# Altium project pca10090.PrjPCB (part 1 of 5)
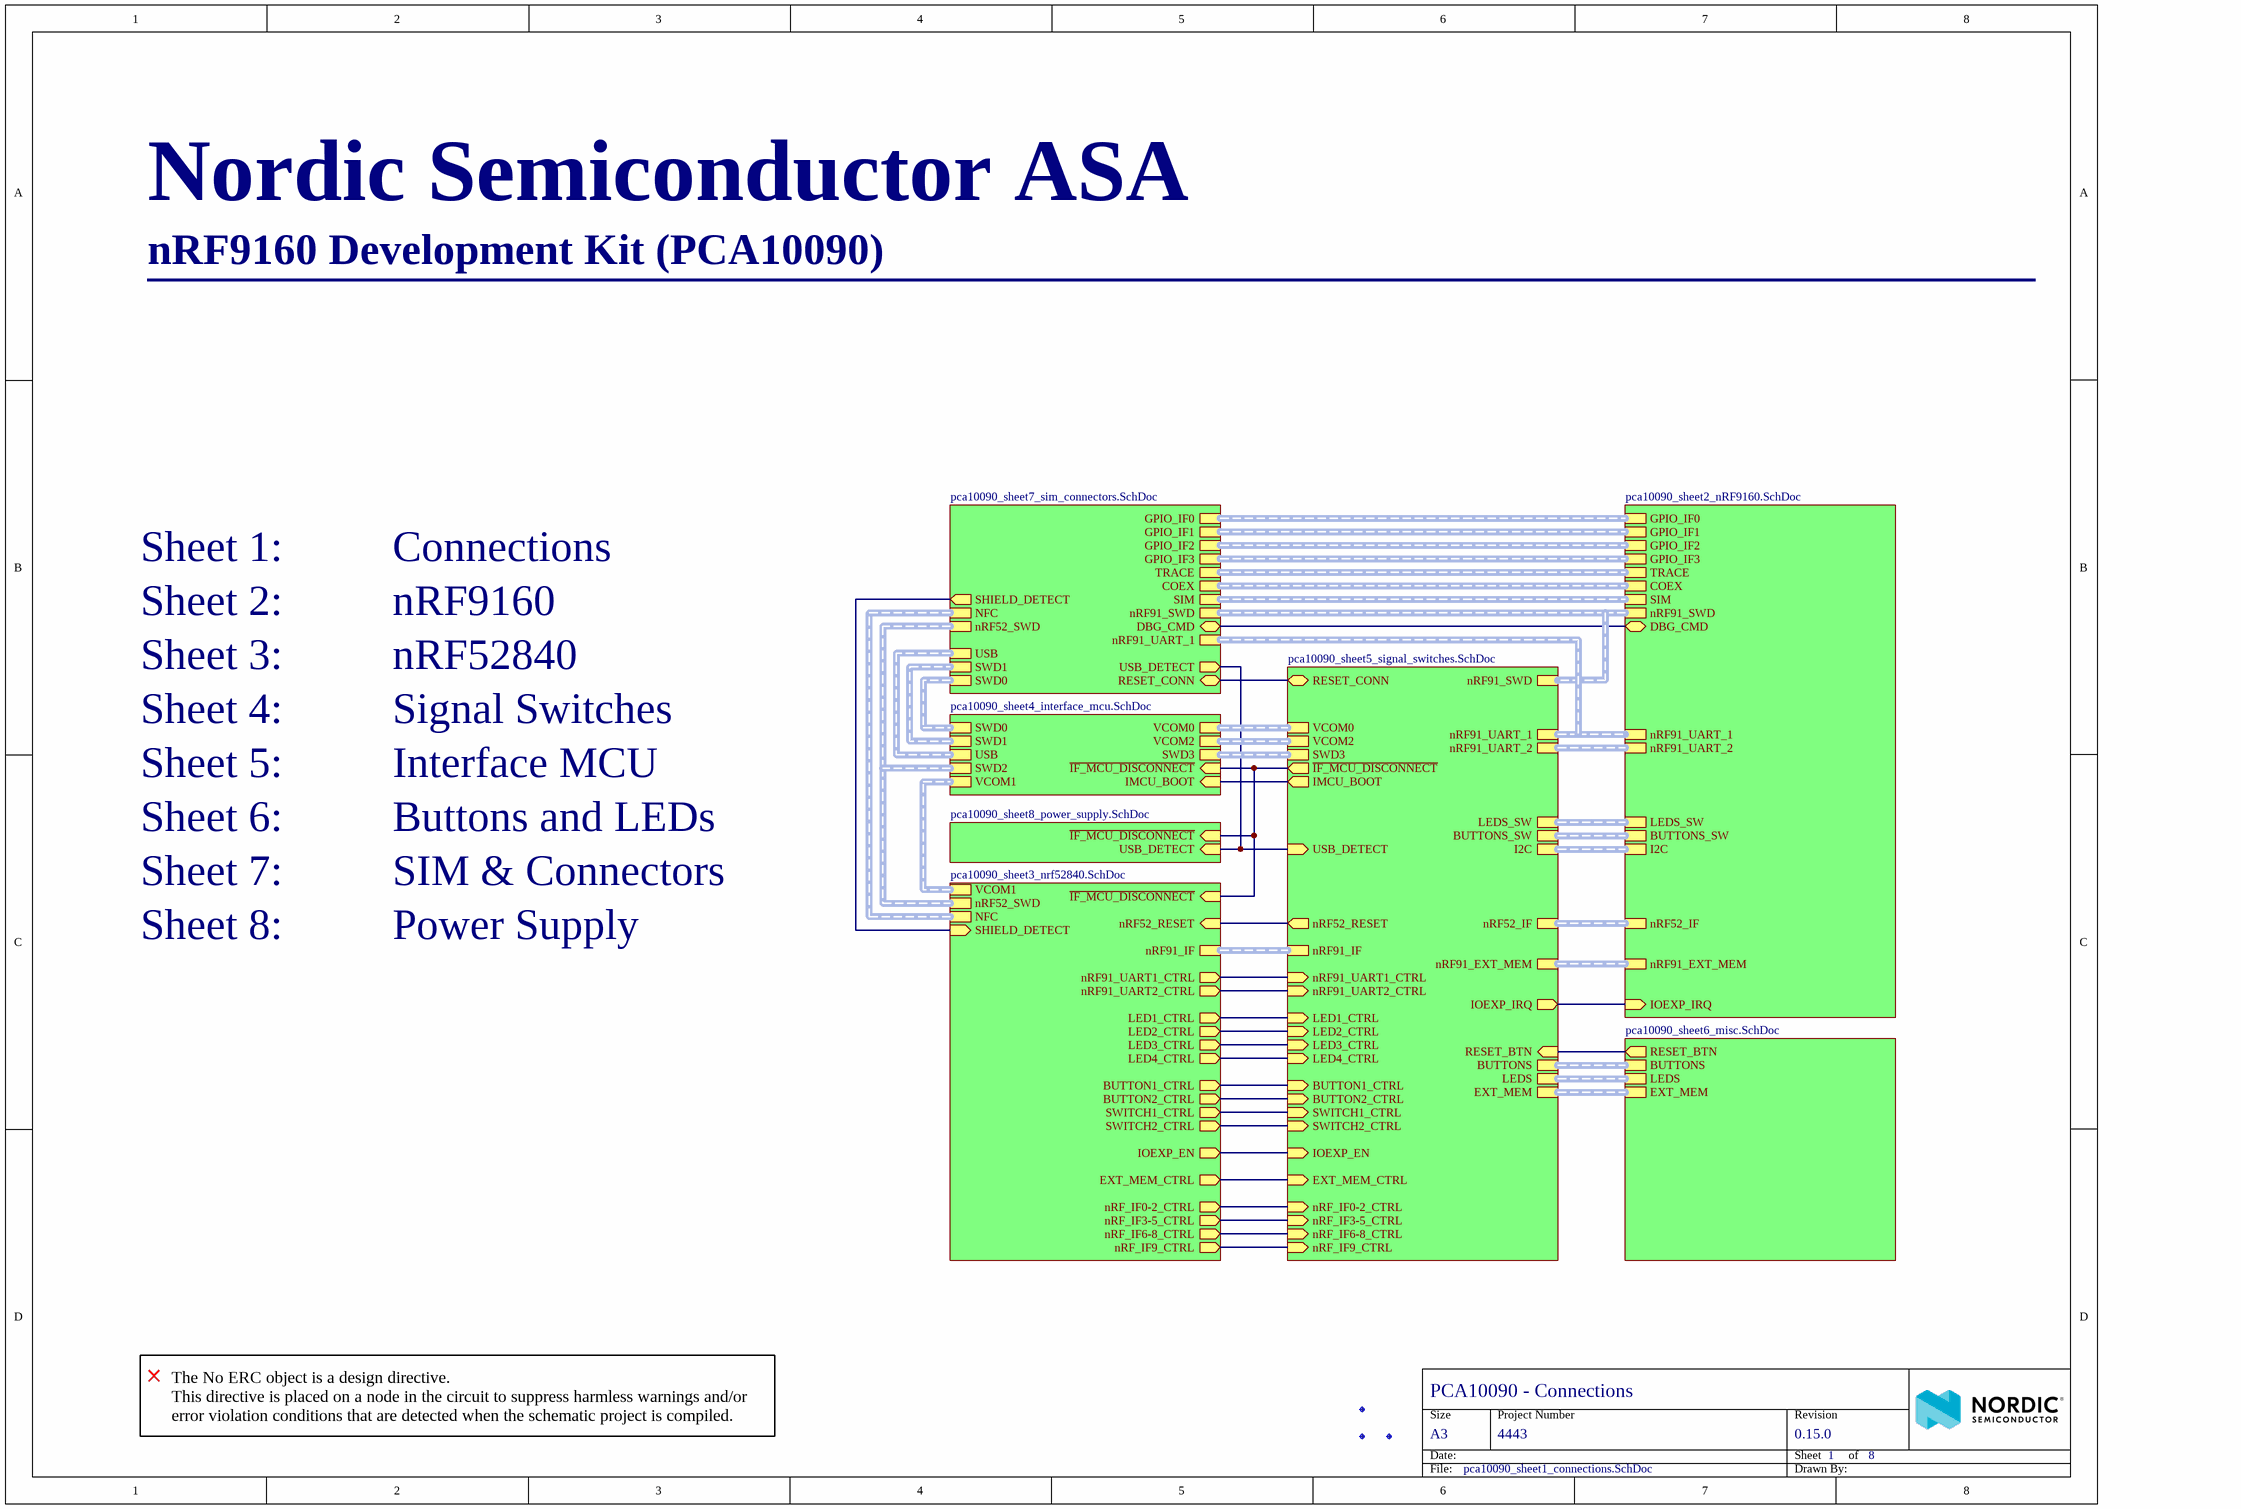
[diagram p0: pca10090_sheet1_connections.SchDoc]
SurfaceFinish: ENIG; SoldermaskColor: Blue; SilkscreenColor: White; Revision: 0.15.0; ProjectNumber: 4443; ProjectName: nRF9160-DK; PCBStackup: 4021; PCBRevision: 0386RUBR; PCBNumber: 400389; PCAName: PCA10090; Organization: Nordic Semiconductor; NrOfLayers: 4; BoardTitle: nRF9160-DK; BoardThickness: 1.6mm; Author: RUBR
8 sheets, 434 parts. Net scope: hierarchical (ports join the sheet entries above them; power ports are global).
Board file: 400389.PcbDoc
Sheets:
  pca10090_sheet1_connections.SchDoc
     = pca10090_sheet2_nRF9160.SchDoc
     = pca10090_sheet3_nrf52840.SchDoc
     = pca10090_sheet4_interface_mcu.SchDoc
     = pca10090_sheet5_signal_switches.SchDoc
     = pca10090_sheet6_misc.SchDoc
     = pca10090_sheet7_sim_connectors.SchDoc
     = pca10090_sheet8_power_supply.SchDoc

## Sheet pca10090_sheet1_connections.SchDoc: PCA10090 - Connections
size A3; Organization: Nordic Semiconductor; DocumentNumber: 1; Revision: 0.15.0; SheetNumber: 1; SheetTotal: 8; Author: RUBR; CompanyName: Nordic Semiconductor; DrawnBy: RUBR; DocumentSize: A4; ProjectName: nRF9160-DK

### Parts
Fid1  Fiducial mark  [Fiducial]  (value not drawn)
Fid2  Fiducial mark  [Fiducial]  (value not drawn)
Fid3  Fiducial mark  [Fiducial]  (value not drawn)

### Sub-sheets
? = pca10090_sheet2_nRF9160.SchDoc: nRF91_SWD (harness SWD), DBG_CMD (bidir), nRF91_UART_1 (harness UART), COEX (harness COEX), nRF91_UART_2 (harness UART), SIM (harness SIM), I2C (harness I2C), GPIO_IF1 (harness GPIO_IF1), GPIO_IF0 (harness GPIO_IF0), GPIO_IF2 (harness GPIO_IF2), GPIO_IF3 (harness GPIO_IF3), TRACE (harness TRACE), BUTTONS_SW (harness UI), LEDS_SW (harness UI), nRF52_IF (harness nRF_IF), IOEXP_IRQ (in), nRF91_EXT_MEM (harness MEMORY)
? = pca10090_sheet3_nrf52840.SchDoc: BUTTON1_CTRL (out), nRF_IF0-2_CTRL (out), nRF91_UART2_CTRL (out), LED4_CTRL (out), LED3_CTRL (out), nRF_IF6-8_CTRL (out), nRF_IF3-5_CTRL (out), SWITCH1_CTRL (out), ~{IF_MCU_DISCONNECT} (in), SHIELD_DETECT (in), VCOM1 (harness UART), LED1_CTRL (out), LED2_CTRL (out), SWITCH2_CTRL (out), BUTTON2_CTRL (out), NFC (harness NFC), nRF91_IF (harness nRF_IF), nRF91_UART1_CTRL (out), nRF52_SWD (harness SWD), IOEXP_EN (out), nRF52_RESET (in), nRF_IF9_CTRL (out), EXT_MEM_CTRL (out)
? = pca10090_sheet4_interface_mcu.SchDoc: VCOM1 (harness UART), VCOM0 (harness UART), VCOM2 (harness UART), ~{IF_MCU_DISCONNECT} (in), IMCU_BOOT (in), SWD3 (harness SWD), SWD1 (harness SWD), USB (harness USB), SWD0 (harness SWD), SWD2 (harness SWD)
? = pca10090_sheet5_signal_switches.SchDoc: LED2_CTRL (in), ~{IF_MCU_DISCONNECT} (out), nRF52_IF (harness nRF_IF), BUTTONS (harness UI), VCOM2 (harness UART), RESET_BTN (in), nRF91_SWD (harness SWD), VCOM0 (harness UART), BUTTON2_CTRL (in), BUTTON1_CTRL (in), SWD3 (harness SWD), nRF_IF3-5_CTRL (in), nRF91_UART_1 (harness UART), nRF91_UART_2 (harness UART), nRF91_UART1_CTRL (in), LED1_CTRL (in), IMCU_BOOT (out), LEDS (harness UI), nRF_IF6-8_CTRL (in), nRF91_UART2_CTRL (in), LED3_CTRL (in), LED4_CTRL (in), SWITCH2_CTRL (in), nRF_IF0-2_CTRL (in), SWITCH1_CTRL (in), RESET_CONN (bidir), USB_DETECT (in), I2C (harness I2C), LEDS_SW (harness UI), BUTTONS_SW (harness UI), nRF91_IF (harness nRF_IF), IOEXP_EN (in), IOEXP_IRQ (out), nRF52_RESET (out), nRF_IF9_CTRL (in), nRF91_EXT_MEM (harness MEMORY), EXT_MEM_CTRL (in), EXT_MEM (harness MEMORY)
? = pca10090_sheet6_misc.SchDoc: BUTTONS (harness UI), LEDS (harness UI), RESET_BTN (out), EXT_MEM (harness MEMORY)
? = pca10090_sheet7_sim_connectors.SchDoc: NFC (harness NFC), COEX (harness COEX), nRF91_SWD (harness SWD), DBG_CMD (bidir), GPIO_IF3 (harness GPIO_IF3), GPIO_IF0 (harness GPIO_IF0), TRACE (harness TRACE), USB_DETECT (out), USB (harness USB), SIM (harness SIM), nRF52_SWD (harness SWD), GPIO_IF1 (harness GPIO_IF1), GPIO_IF2 (harness GPIO_IF2), SWD0 (harness SWD), SWD1 (harness SWD), RESET_CONN (bidir), SHIELD_DETECT (out), nRF91_UART_1 (harness UART)
? = pca10090_sheet8_power_supply.SchDoc: ~{IF_MCU_DISCONNECT} (in), USB_DETECT (in)

### Nets
~{IF_MCU_DISCONNECT}: sheet /~{IF_MCU_DISCONNECT}, sheet /~{IF_MCU_DISCONNECT}, sheet /~{IF_MCU_DISCONNECT}, sheet /~{IF_MCU_DISCONNECT}
IMCU_BOOT: sheet /IMCU_BOOT, sheet /IMCU_BOOT
IOEXP_EN: sheet /IOEXP_EN, sheet /IOEXP_EN
nRF52_P0.02/AIN0: sheet /SHIELD_DETECT, sheet /SHIELD_DETECT
nRF52_P0.06: sheet /BUTTON1_CTRL, sheet /BUTTON1_CTRL
nRF52_P0.08: sheet /SWITCH2_CTRL, sheet /SWITCH2_CTRL
nRF52_P0.13: sheet /nRF_IF0-2_CTRL, sheet /nRF_IF0-2_CTRL
nRF52_P0.16: sheet /nRF_IF9_CTRL, sheet /nRF_IF9_CTRL
nRF52_P0.18/RESET: sheet /nRF52_RESET, sheet /nRF52_RESET
nRF52_P0.19: sheet /EXT_MEM_CTRL, sheet /EXT_MEM_CTRL
nRF52_P0.24: sheet /nRF_IF3-5_CTRL, sheet /nRF_IF3-5_CTRL
nRF52_P0.26: sheet /BUTTON2_CTRL, sheet /BUTTON2_CTRL
nRF52_P1.01: sheet /LED3_CTRL, sheet /LED3_CTRL
nRF52_P1.03: sheet /LED4_CTRL, sheet /LED4_CTRL
nRF52_P1.05: sheet /LED1_CTRL, sheet /LED1_CTRL
nRF52_P1.07: sheet /LED2_CTRL, sheet /LED2_CTRL
nRF52_P1.09: sheet /SWITCH1_CTRL, sheet /SWITCH1_CTRL
nRF52_P1.10: sheet /nRF_IF6-8_CTRL, sheet /nRF_IF6-8_CTRL
nRF52_P1.12: sheet /nRF91_UART2_CTRL, sheet /nRF91_UART2_CTRL
nRF52_P1.14: sheet /nRF91_UART1_CTRL, sheet /nRF91_UART1_CTRL
P0.06: sheet /IOEXP_IRQ, sheet /IOEXP_IRQ
RESET_CONN: sheet /RESET_CONN, sheet /RESET_CONN
NetJ8_3: sheet /DBG_CMD, sheet /DBG_CMD
NetQ7_3: sheet /USB_DETECT, sheet /USB_DETECT, sheet /USB_DETECT
NetSB16_1: sheet /RESET_BTN, sheet /RESET_BTN

### Buses and harness runs
harness sheet /nRF52_SWD = sheet /SWD2

### Notes on the sheet
- Nordic Semiconductor ASA
- nRF9160 Development Kit (PCA10090)
- ________________________________________________________________
- Sheet 1:          Connections
- Sheet 2:          nRF9160
- Sheet 3:          nRF52840
- Sheet 4:          Signal Switches
- Sheet 5:          Interface MCU
- Sheet 6:          Buttons and LEDs
- Sheet 7:          SIM & Connectors
- Sheet 8:          Power Supply
- The No ERC object is a design directive.
  This directive is placed on a node in the circuit to suppress harmless warnings and/or error violation conditions that are detected when the schematic project is compiled.
- Size
- Date:
- A3
- Project Number
- Sheet         of
- Revision
- File:
- Drawn By:

### Library data of the parts
Fid1-Fid3 = Fid-Mark: Artikkelnr Noca: N.A.; Part Number: Fid-Mark; Manufacturer: *; Manufacturer Part Number: *; LatestRevisionDate: 2009-12-12; Pin Count: 1; Publisher: Nordic Semiconductor; Published: 2009-12-12; Value: *; Note: *; Footprint Doc: Fiducial; Part number IPS: N.A.; ComponentLink1URL: *; ComponentLink1Description: Datasheet; ComponentLink2URL: *; ComponentLink2Description: Supplier link; HelpURL: *; Supplier 1: *; Supplier Part Number 1: *; Supplier 2: *; Supplier Part Number 2: *

## Sheet pca10090_sheet2_nRF9160.SchDoc: PCA10090 - nRF9160
size A3; Organization: Nordic Semiconductor; DocumentNumber: 2; Revision: 0.15.0; SheetNumber: 2; SheetTotal: 8; Author: RUBR; CompanyName: Nordic Semiconductor; DrawnBy: RUBR; DocumentSize: A3; ProjectName: nRF9160-DK
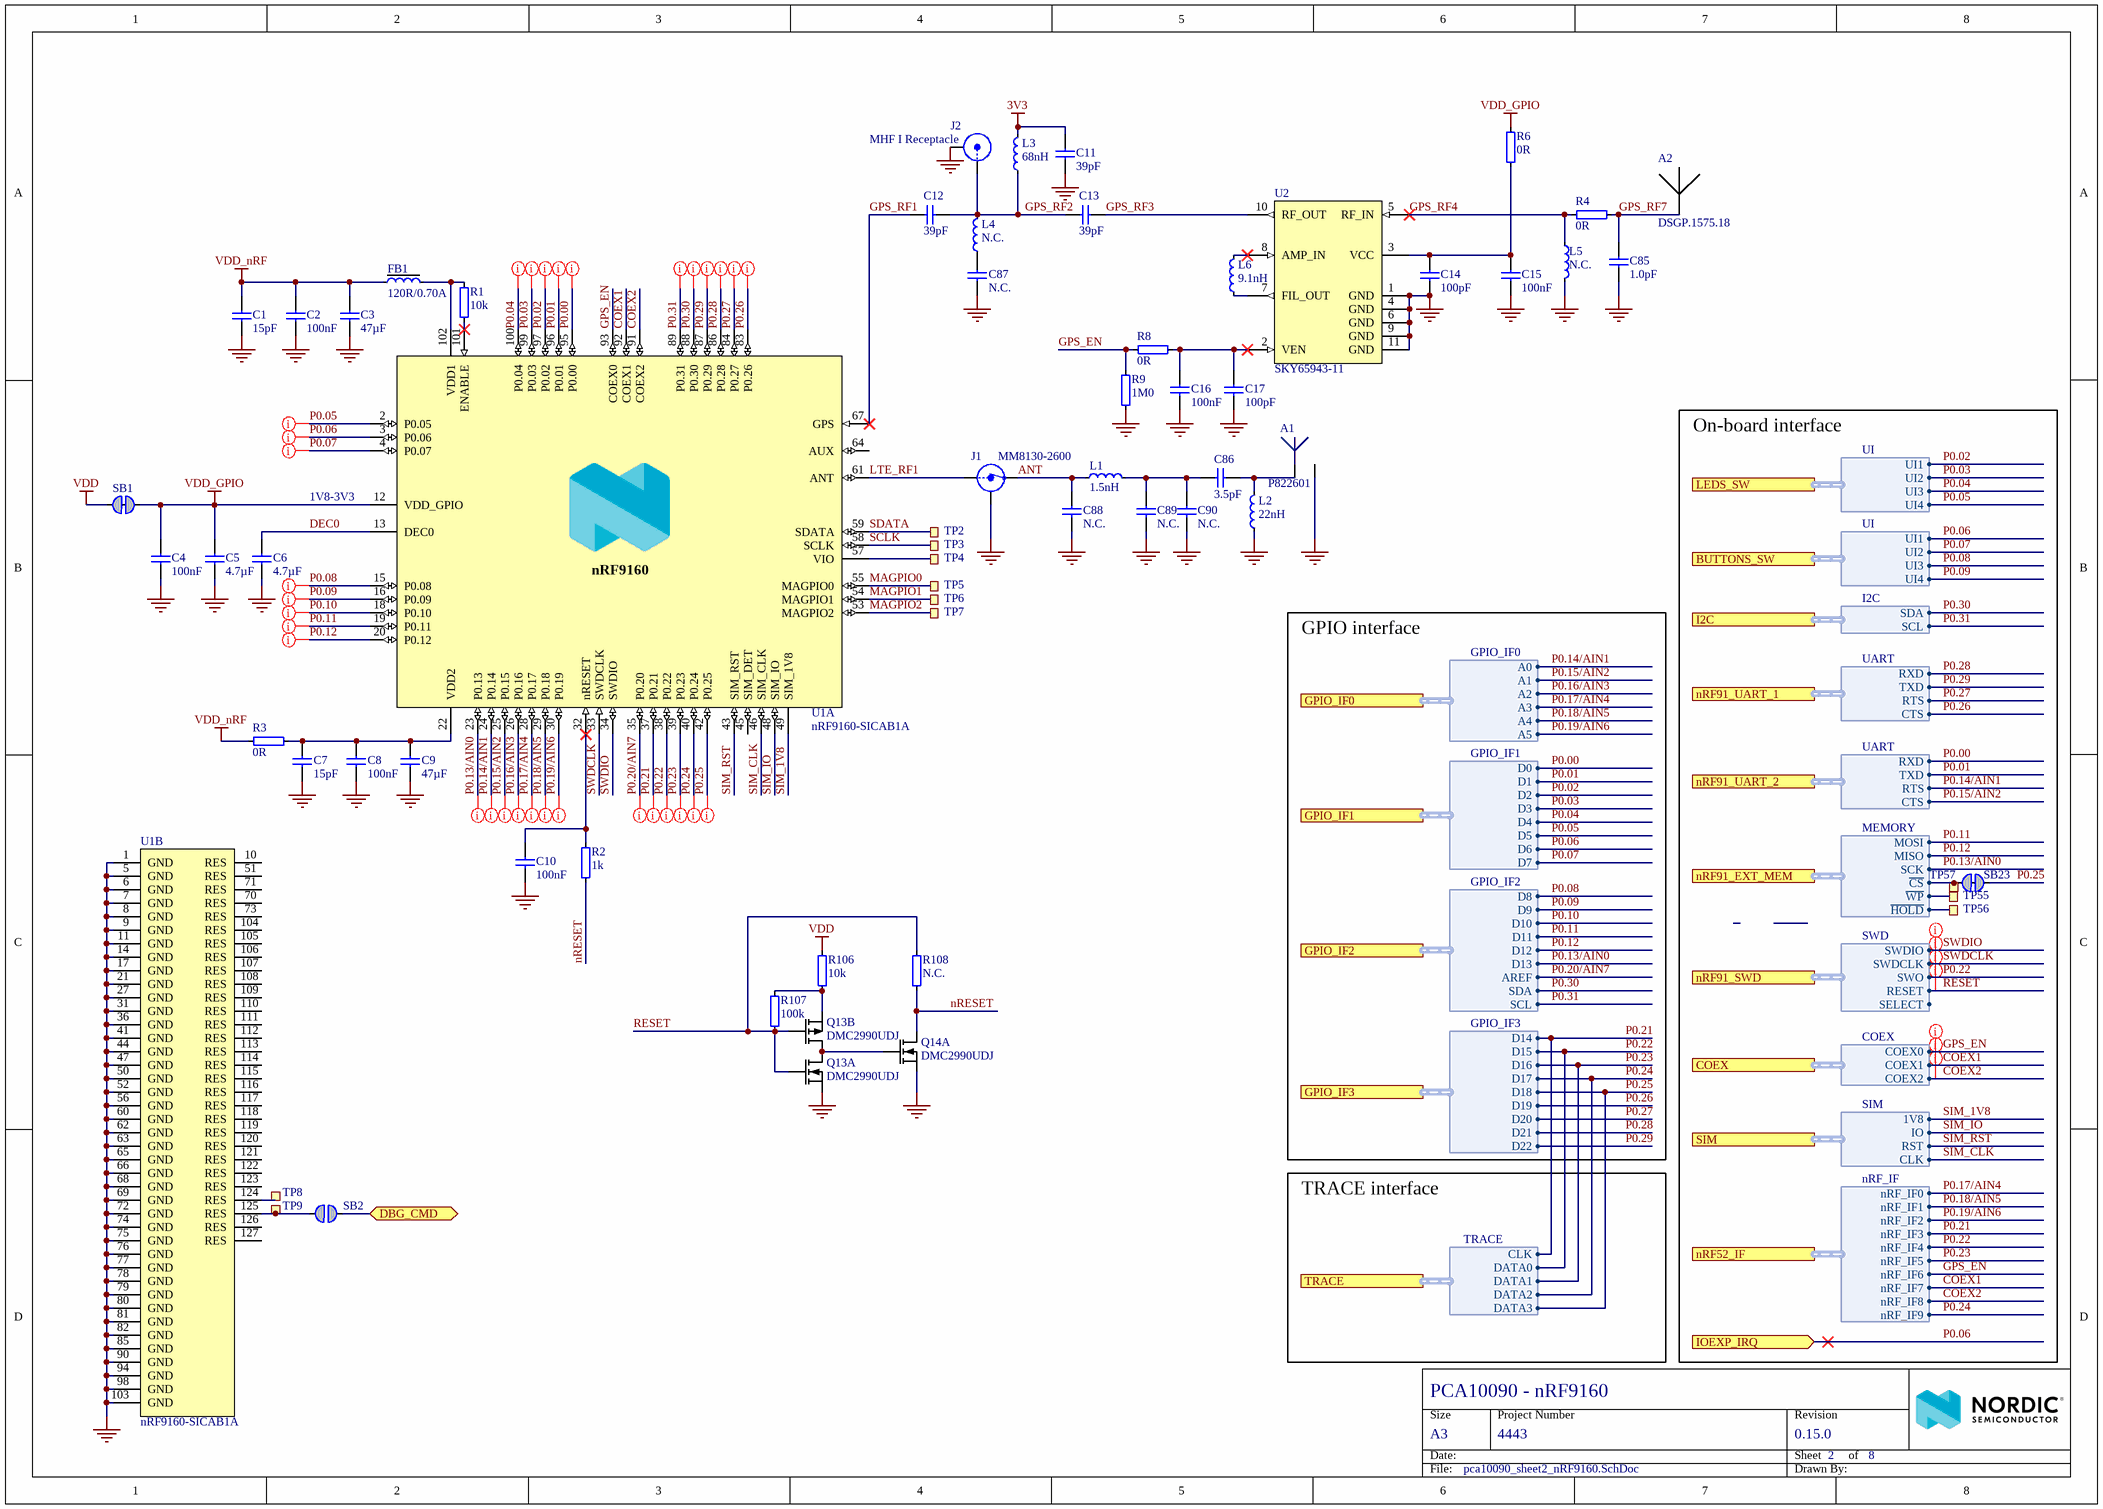
[diagram p1: pca10090_sheet2_nRF9160.SchDoc]

### Parts
A1  P822601  [P822601]
A2  DSGP.1575.18  [DSGP.1575.18]
C1  15pF  [CAPC0603X03L_C]
C2  100nF  [CAPC0603X03L_C]
C3  47µF  [CAPC2012X11L]
C4  100nF  [CAPC0603X03L_C]
C5  4.7µF  [CAPC1005X04L]
C6  4.7µF  [CAPC2012X11L]
C7  15pF  [CAPC0603X03L_C]
C8  100nF  [CAPC0603X03L_C]
C9  47µF  [CAPC2012X11L]
C10  100nF  [CAPC0603X03L_C]
C11  39pF  [CAPC0603X03L_C]
C12  39pF  [CAPC0603X03L_C]
C13  39pF  [CAPC0603X03L_C]
C14  100pF  [CAPC0603X03L_C]
C15  100nF  [CAPC0603X03L_C]
C16  100nF  [CAPC0603X03L_C]
C17  100pF  [CAPC0603X03L_C]
C85  1.0pF  [CAPC1005X04L]
C86  3.5pF  [CAPC0603X03L_C]
C87  N.C.  [CAPC0603X03L_C_NC]
C88  N.C.  [CAPC0603X03L_C_NC]
C89  N.C.  [CAPC0603X03L_C_NC]
C90  N.C.  [CAPC0603X03L_C_NC]
FB1  120R/0.70A  [INDC1005X04L]
J1  MM8130-2600  [COAXIAL-SWF]
J2  MHF I Receptacle  [COAXIAL RF U.FL-R-SMT-1]
L1  1.5nH  [INDC0603X03L_C]
L2  22nH  [INDC0603X03L_C]
L3  68nH  [INDC1005X04L_WW]
L4  N.C.  [INDC1005X04L_NC]
L5  N.C.  [INDC1005X04L_NC]
L6  9.1nH  [INDC1005X04L_WW]
Q13  DMC2990UDJ  [SOTFL35P100X50-6N]  (parts A,B of 2)
Q14  DMC2990UDJ  [SOTFL35P100X50-6N]  (part A of 2)
R1  10k  [RESC0603X03L_C]
R2  1k  [RESC0603X03L_C]
R3  0R  [RESC0603X03L_C]
R4  0R  [RESC1005X04L]
R6  0R  [RESC0603X03L_C]
R8  0R  [RESC0603X03L_C]
R9  1M0  [RESC0603X03L_C]
R106  10k  [RESC0603X03L_C]
R107  100k  [RESC0603X03L_C]
R108  N.C.  [RESC0603X03L_C_NC]
SB1  Solderbridge  [Solderbridge_Shorted]  (value not drawn)  (net tie, no BOM)
SB2  Solderbridge  [Solderbridge]  (value not drawn)  (no BOM)
SB23  Solderbridge  [Solderbridge_Shorted]  (value not drawn)  (net tie, no BOM)
TP2  Ø1.0mm,SMD  [TP_SMD_Ø1.0mm]  (value not drawn)  (no BOM)
TP3  Ø1.0mm,SMD  [TP_SMD_Ø1.0mm]  (value not drawn)  (no BOM)
TP4  Ø1.0mm,SMD  [TP_SMD_Ø1.0mm]  (value not drawn)  (no BOM)
TP5  Ø1.0mm,SMD  [TP_SMD_Ø1.0mm]  (value not drawn)  (no BOM)
TP6  Ø1.0mm,SMD  [TP_SMD_Ø1.0mm]  (value not drawn)  (no BOM)
TP7  Ø1.0mm,SMD  [TP_SMD_Ø1.0mm]  (value not drawn)  (no BOM)
TP8  Ø1.0mm,SMD  [TP_SMD_Ø1.0mm]  (value not drawn)  (no BOM)
TP9  Ø1.0mm,SMD  [TP_SMD_Ø1.0mm]  (value not drawn)  (no BOM)
TP55  Ø1.5mm,SMD  [TP_SMD_Ø1.5mm]  (value not drawn)  (no BOM)
TP56  Ø1.5mm,SMD  [TP_SMD_Ø1.5mm]  (value not drawn)  (no BOM)
TP57  Ø1.5mm,SMD  [TP_SMD_Ø1.5mm]  (value not drawn)  (no BOM)
U1  nRF9160-SICAB1A  [LGA50P1600X1050X104-161N]  (parts A,B of 2)
U2  SKY65943-11  [SKY65943-11]

### Blocks framed on the sheet
On-board interface: SB23 TP55-TP57

### Ports
BUTTONS_SW (harness UI), COEX (harness COEX), DBG_CMD (bidir), GPIO_IF0 (harness GPIO_IF0), GPIO_IF1 (harness GPIO_IF1), GPIO_IF2 (harness GPIO_IF2), GPIO_IF3 (harness GPIO_IF3), I2C (harness I2C), IOEXP_IRQ (in), LEDS_SW (harness UI), nRF52_IF (harness nRF_IF), nRF91_EXT_MEM (harness MEMORY), nRF91_SWD (harness SWD), nRF91_UART_1 (harness UART), nRF91_UART_2 (harness UART), SIM (harness SIM), TRACE (harness TRACE)

### Harnesses
COEX: COEX0, COEX2, COEX1
UART: RTS, CTS, RXD, TXD
SIM: CLK, IO, 1V8, RST
SWD: SWDIO, SWDCLK, SWO, RESET, SELECT
I2C: SCL, SDA
GPIO_IF1: D0, D1, D2, D3, D4, D5, D6, D7
GPIO_IF2: D8, D9, D10, D11, D12, D13, AREF, SDA, SCL
GPIO_IF0: A0, A1, A2, A3, A4, A5
GPIO_IF3: D14, D15, D16, D17, D18, D19, D20, D21, D22
TRACE: CLK, DATA0, DATA1, DATA3, DATA2
UI: UI4, UI3, UI2, UI1
nRF_IF: nRF_IF0, nRF_IF1, nRF_IF2, nRF_IF3, nRF_IF4, nRF_IF5, nRF_IF6, nRF_IF7, nRF_IF8, nRF_IF9
MEMORY: SCK, ~{CS}, MOSI, MISO, ~{WP}, ~{HOLD}

### Nets
3V3: C11.2 L3.1
GND: A1.2 A2.2(GND) C1.2 C2.2 C3.2 C4.2 C5.2 C6.2 C7.2 C8.2 C9.2 C10.2 C11.1 C14.1 C15.1 C16.1 C17.1 C85.2 C87.1 C88.1 C89.1 C90.1 J1.2(Shield) J2.2(Y) L2.1 L5.2 Q13.1(S1) Q14.1(S1) R9.1 U1.1(GND) U1.5(GND) U1.6(GND) U1.7(GND) U1.8(GND) U1.9(GND) U1.11(GND) U1.14(GND) U1.17(GND) U1.21(GND) U1.27(GND) U1.31(GND) U1.36(GND) U1.41(GND) U1.44(GND) U1.47(GND) U1.50(GND) U1.52(GND) U1.56(GND) U1.60(GND) U1.62(GND) U1.63(GND) U1.65(GND) U1.66(GND) U1.68(GND) U1.69(GND) U1.72(GND) U1.74(GND) U1.75(GND) U1.76(GND) U1.77(GND) U1.78(GND) U1.79(GND) U1.80(GND) U1.81(GND) U1.82(GND) U1.85(GND) U1.90(GND) U1.94(GND) U1.98(GND) U1.103(GND) U2.1(GND) U2.4(GND) U2.6(GND) U2.9(GND) U2.11(GND)
VDD: R106.1 SB1.1
VDD_GPIO: C4.1 C5.1 R6.2 SB1.2 U1.12(VDD_GPIO)
VDD_nRF: C1.1 C2.1 C3.1 FB1.1 R3.1
ANT: C88.2 J1.3(OUT) L1.1
COEX1: U1.92(COEX1) ; port COEX.COEX1, port nRF52_IF.nRF_IF7
COEX2: U1.91(COEX2) ; port COEX.COEX2, port nRF52_IF.nRF_IF8
DEC0: C6.1 U1.13(DEC0)
GPS_EN: R8.1 R9.2 U1.93(COEX0) ; port COEX.COEX0, port nRF52_IF.nRF_IF6
GPS_RF1: C12.2 U1.67(GPS)
GPS_RF2: C12.1 C13.2 J2.1(X) L3.2 L4.1
GPS_RF3: C13.1 U2.10(RF_OUT)
GPS_RF4: L5.1 R4.1 U2.5(RF_IN)
GPS_RF7: A2.1 C85.1 R4.2
LTE_RF1: J1.1(IN) U1.61(ANT)
MAGPIO0: TP5.1 U1.55(MAGPIO0)
MAGPIO1: TP6.1 U1.54(MAGPIO1)
MAGPIO2: TP7.1 U1.53(MAGPIO2)
nRESET: Q14.6(D1) R2.1 R108.2
P0.00: U1.95(P0.00) ; port nRF91_UART_2.RXD, port GPIO_IF1.D0
P0.01: U1.96(P0.01) ; port nRF91_UART_2.TXD, port GPIO_IF1.D1
P0.02: U1.97(P0.02) ; port GPIO_IF1.D2, port LEDS_SW.UI1
P0.03: U1.99(P0.03) ; port GPIO_IF1.D3, port LEDS_SW.UI2
P0.04: U1.100(P0.04) ; port GPIO_IF1.D4, port LEDS_SW.UI3
P0.05: U1.2(P0.05) ; port GPIO_IF1.D5, port LEDS_SW.UI4
P0.06: U1.3(P0.06) ; port IOEXP_IRQ, port GPIO_IF1.D6, port BUTTONS_SW.UI1
P0.07: U1.4(P0.07) ; port GPIO_IF1.D7, port BUTTONS_SW.UI2
P0.08: U1.15(P0.08) ; port GPIO_IF2.D8, port BUTTONS_SW.UI3
P0.09: U1.16(P0.09) ; port GPIO_IF2.D9, port BUTTONS_SW.UI4
P0.10: U1.18(P0.10) ; port GPIO_IF2.D10
P0.11: U1.19(P0.11) ; port GPIO_IF2.D11, port nRF91_EXT_MEM.MOSI
P0.12: U1.20(P0.12) ; port GPIO_IF2.D12, port nRF91_EXT_MEM.MISO
P0.13/AIN0: U1.23(P0.13) ; port GPIO_IF2.D13, port nRF91_EXT_MEM.SCK
P0.14/AIN1: U1.24(P0.14) ; port nRF91_UART_2.RTS, port GPIO_IF0.A0
P0.15/AIN2: U1.25(P0.15) ; port nRF91_UART_2.CTS, port GPIO_IF0.A1
P0.16/AIN3: U1.26(P0.16) ; port GPIO_IF0.A2
P0.17/AIN4: U1.28(P0.17) ; port GPIO_IF0.A3, port nRF52_IF.nRF_IF0
P0.18/AIN5: U1.29(P0.18) ; port GPIO_IF0.A4, port nRF52_IF.nRF_IF1
P0.19/AIN6: U1.30(P0.19) ; port GPIO_IF0.A5, port nRF52_IF.nRF_IF2
P0.20/AIN7: U1.35(P0.20) ; port GPIO_IF2.AREF
P0.21: U1.37(P0.21) ; port GPIO_IF3.D14, port TRACE.CLK, port nRF52_IF.nRF_IF3
P0.22: U1.38(P0.22) ; port nRF91_SWD.SWO, port GPIO_IF3.D15, port TRACE.DATA0, port nRF52_IF.nRF_IF4
P0.23: U1.39(P0.23) ; port GPIO_IF3.D16, port TRACE.DATA1, port nRF52_IF.nRF_IF5
P0.24: U1.40(P0.24) ; port GPIO_IF3.D17, port TRACE.DATA2, port nRF52_IF.nRF_IF9
P0.25: SB23.1 U1.42(P0.25) ; port GPIO_IF3.D18, port TRACE.DATA3
P0.26: U1.83(P0.26) ; port nRF91_UART_1.CTS, port GPIO_IF3.D19
P0.27: U1.84(P0.27) ; port nRF91_UART_1.RTS, port GPIO_IF3.D20
P0.28: U1.86(P0.28) ; port nRF91_UART_1.RXD, port GPIO_IF3.D21
P0.29: U1.87(P0.29) ; port nRF91_UART_1.TXD, port GPIO_IF3.D22
P0.30: U1.88(P0.30) ; port I2C.SDA, port GPIO_IF2.SDA
P0.31: U1.89(P0.31) ; port I2C.SCL, port GPIO_IF2.SCL
RESET: Q13.2(G1) Q13.5(G2) R107.1 R108.1 ; port nRF91_SWD.RESET
SCLK: TP3.1 U1.58(SCLK)
SDATA: TP2.1 U1.59(SDATA)
SIM_1V8: U1.49(SIM_1V8) ; port SIM.1V8
SIM_CLK: U1.46(SIM_CLK) ; port SIM.CLK
SIM_IO: U1.48(SIM_IO) ; port SIM.IO
SIM_RST: U1.43(SIM_RST) ; port SIM.RST
SWDCLK: U1.33(SWDCLK) ; port nRF91_SWD.SWDCLK
SWDIO: U1.34(SWDIO) ; port nRF91_SWD.SWDIO
NetA1_1: A1.1 C86.2 L2.2
NetC7_1: C7.1 C8.1 C9.1 R3.2 U1.22(VDD2)
NetC10_1: C10.1 R2.2 U1.32(nRESET)
NetC14_2: C14.2 C15.2 R6.1 U2.3(VCC)
NetC16_2: C16.2 C17.2 R8.2 U2.2(VEN)
NetC86_1: C86.1 C89.2 C90.2 L1.2
NetC87_2: C87.2 L4.2
NetFB1_2: FB1.2 R1.1 U1.102(VDD1)
NetJ8_3: SB2.1 ; port DBG_CMD
NetL6_1: L6.1 U2.8(AMP_IN)
NetL6_2: L6.2 U2.7(FIL_OUT)
NetQ13_3: Q13.3(D2) Q13.6(D1) Q14.2(G1)
NetQ13_4: Q13.4(S2) R106.2 R107.2
NetR1_2: R1.2 U1.101(ENABLE)
NetSB2_2: SB2.2 TP9.1 U1.125(RES)
NetSB23_2: SB23.2 TP57.1 ; port nRF91_EXT_MEM.~{CS}
NetTP4_1: TP4.1 U1.57(VIO)
NetTP8_1: TP8.1 U1.124(RES)
NetTP55_1: TP55.1 ; port nRF91_EXT_MEM.~{WP}
NetTP56_1: TP56.1 ; port nRF91_EXT_MEM.~{HOLD}

Not connected (* = marked no-connect by the designer): U1 10(RES) 45(SIM_DET) 51(RES) 64(AUX) 70(RES) 71(RES) 73(RES) 104(RES) 105(RES) 106(RES) 107(RES) 108(RES) 109(RES) 110(RES) 111(RES) 112(RES) 113(RES) 114(RES) 115(RES) 116(RES) 117(RES) 118(RES) 119(RES) 120(RES) 121(RES) 122(RES) 123(RES) 126(RES) 127(RES)

### Layout directives
net class GPIO: P0.00, P0.01, P0.02, P0.03, P0.04, P0.05, P0.06, P0.07, P0.08, P0.09, P0.10, P0.11, P0.12, P0.13/AIN0, P0.14/AIN1, P0.15/AIN2, P0.16/AIN3, P0.17/AIN4, P0.18/AIN5, P0.19/AIN6, P0.20/AIN7, P0.21, P0.22, P0.23, P0.24, P0.25, P0.26, P0.27, P0.28, P0.29, P0.30, P0.31
net class SWD: P0.22, RESET, SWDCLK, SWDIO
net class COEX: COEX1, COEX2, GPS_EN

### Notes on the sheet
- 1V8-3V3
- GPIO interface
- TRACE interface
- Size
- Date:
- A3
- Project Number
- Sheet         of
- Revision
- File:
- Drawn By:
- (in symbol nRF9160-SICAB1A, part A) nRF9160

### Library data of the parts
A1 = P822601: ANTENNA PRESTTA OCTABAND LTE; Manufacturer: Ethertronics; Part number IPS: 00000009001; Artikkelnr Noca: N.A.; Part Number: P822601; Manufacturer Part Number: P822601; Footprint Doc: P822601; LatestRevisionDate: 2017-07-28; Pin Count: 2; Publisher: Nordic Semiconductor; Published: 2017-07-28; Value: P822601; Note: *; ComponentLink1URL: *; ComponentLink1Description: Datasheet; ComponentLink2URL: *; ComponentLink2Description: Supplier link; HelpURL: http://www.ethertronics.com/wp-content/uploads/2016/11/Prestta-P822601-P822602-Standard-Cellular-Octa-Band-20160904.pdf; Supplier 1: moreelectronics.dk; Supplier Part Number 1: P822601; Supplier 2: Digikey; Supplier Part Number 2: 939-1057-1-ND
A2 = DSGP.1575.18.4.A.02: 18 x 18 mm Low Profile GPS L1 / GALILEO E1 Passive Patch Antenna; Manufacturer: Taoglas; Artikkelnr Noca: N.A.; Part Number: DSGP.1575.18.4.A.02; Manufacturer Part Number: DSGP.1575.18.4.A.02; ComponentLink1URL: https://www.taoglas.com/datasheets/DSGP.1575.18.4.A.02.pdf; ComponentLink1Description: Datasheet; ComponentLink2URL: https://www.digikey.com/product-detail/en/taoglas-limited/DSGP.1575.18.4.A.02/931-1511-1-ND/8275289; ComponentLink2Description: Supplier link; HelpURL: https://www.taoglas.com/product/18184mm-dsgp-1575-184-gps-l1-galileo-e1-ceramic-patch-copy/?compare=16929; Footprint Doc: DSGP.1575.18; LatestRevisionDate: 2020-01-24; Pin Count: 2; Publisher: Nordic Semiconductor; Published: 2020-01-24; Value: DSGP.1575.18; Note: *; Supplier 1: Digi-Key; Supplier Part Number 1: 931-1511-1-ND; Supplier 2: *; Supplier Part Number 2: *; Part number IPS: N.A.
C1 C7 = C0201-15p: Capacitor, NP0, ±0.1pF, 25V; Note: Chip Cap 1%; Artikkelnr Noca: N.A.; Part Number: C0201-15p; Manufacturer: *; Manufacturer Part Number: *; ComponentLink1URL: *; ComponentLink1Description: Datasheet; ComponentLink2URL: *; ComponentLink2Description: Supplier link; HelpURL: *; Footprint Doc: 0201; LatestRevisionDate: 2014-11-13; Pin Count: 2; Publisher: Nordic Semiconductor; Published: 2014-11-13; Value: 15pF; Part number IPS: N.A.; Supplier 1: *; Supplier Part Number 1: *; Supplier 2: *; Supplier Part Number 2: *
C2 C4 C8 C10 C15 C16 = C0201-100n: Capacitor, X5R, ±10%; Part number IPS: 00000001248, 00000002505; Note: 16V; Artikkelnr Noca: N.A.; Part Number: C0201-100n; Manufacturer: *; Manufacturer Part Number: *; ComponentLink1URL: *; ComponentLink1Description: Datasheet; ComponentLink2URL: *; ComponentLink2Description: Supplier link; HelpURL: *; Footprint Doc: 0201; LatestRevisionDate: 2017-11-09; Pin Count: 2; Publisher: Nordic Semiconductor; Published: 2014-11-13; Value: 100nF; Supplier 1: *; Supplier Part Number 1: *; Supplier 2: *; Supplier Part Number 2: *
C3 C9 = C0805-47µ: Capacitor, X5R, ±20%, 10V; Artikkelnr Noca: N.A.; Part Number: C0805-47µ; Manufacturer: *; Manufacturer Part Number: *; ComponentLink1URL: *; ComponentLink1Description: Datasheet; ComponentLink2URL: *; ComponentLink2Description: Supplier link; HelpURL: *; Footprint Doc: 0805; LatestRevisionDate: 2019-03-15; Pin Count: 2; Publisher: Nordic Semiconductor; Published: 2019-03-15; Value: 47µF; Note: 10V; Part number IPS: N.A.; Supplier 1: *; Supplier Part Number 1: *; Supplier 2: *; Supplier Part Number 2: *
C5 = C0402-4µ7: Capacitor, X5R, ±20%; Part number IPS: 00000001251, 00000007165; Note: 10V; Artikkelnr Noca: 20039482; Part Number: C0402-4µ7; Manufacturer: *; Manufacturer Part Number: *; ComponentLink1URL: *; ComponentLink1Description: Datasheet; ComponentLink2URL: *; ComponentLink2Description: Supplier link; HelpURL: *; Footprint Doc: 0402; LatestRevisionDate: 2017-11-09; Pin Count: 2; Publisher: Nordic Semiconductor; Published: 2009-05-08; Value: 4.7µF; Supplier 1: Digi-Key; Supplier Part Number 1: 490-13252-1-ND; Supplier 2: *; Supplier Part Number 2: *
C6 = C0805-4µ7: Capacitor, X5R, ±10%, 16V; Part number IPS: 00000006289; Artikkelnr Noca: 20039266; Part Number: C0805-4µ7; Manufacturer: *; Manufacturer Part Number: *; ComponentLink1URL: *; ComponentLink1Description: Datasheet; ComponentLink2URL: *; ComponentLink2Description: Supplier link; HelpURL: *; Footprint Doc: 0805; LatestRevisionDate: 2020-04-28; Pin Count: 2; Publisher: Nordic Semiconductor; Published: 2009-08-21; Value: 4.7µF; Note: 16V; Supplier 1: *; Supplier Part Number 1: *; Supplier 2: *; Supplier Part Number 2: *
C11-C13 = C0201-39p: Capacitor, NP0, ±1%, 25V; Manufacturer: Murata; Manufacturer Part Number: GRM0335C1E390FA01; Part number IPS: 00000001668; Artikkelnr Noca: N.A.; Part Number: C0201-39p; ComponentLink1URL: *; ComponentLink1Description: Datasheet; ComponentLink2URL: *; ComponentLink2Description: Supplier link; HelpURL: *; Footprint Doc: 0201; LatestRevisionDate: 2019-04-16; Pin Count: 2; Publisher: Nordic Semiconductor; Published: 2019-04-16; Value: 39pF; Note: 25V; Supplier 1: *; Supplier Part Number 1: *; Supplier 2: *; Supplier Part Number 2: *
C14 C17 = C0201-100p: Capacitor, NP0, ±2%, 25V; Manufacturer: Murata; Manufacturer Part Number: GRM0335C1E101GA01; Part number IPS: 00000007853; Artikkelnr Noca: N.A.; Part Number: C0201-100p; ComponentLink1URL: *; ComponentLink1Description: Datasheet; ComponentLink2URL: *; ComponentLink2Description: Supplier link; HelpURL: *; Footprint Doc: 0201; LatestRevisionDate: 2019-04-16; Pin Count: 2; Publisher: Nordic Semiconductor; Published: 2019-04-16; Value: 100pF; Note: 25V; Supplier 1: *; Supplier Part Number 1: *; Supplier 2: *; Supplier Part Number 2: *
C85 = C0402-1.0p: Capacitor, NP0, ±0.1pF; Part number IPS: N.A.; Note: 50V; Artikkelnr Noca: 20029140; Part Number: C0402-1.0p; Manufacturer: *; Manufacturer Part Number: *; ComponentLink1URL: *; ComponentLink1Description: Datasheet; ComponentLink2URL: *; ComponentLink2Description: Supplier link; HelpURL: *; Footprint Doc: 0402; LatestRevisionDate: 2017-02-23; Pin Count: 2; Publisher: Nordic Semiconductor; Published: 2009-05-08; Value: 1.0pF; Supplier 1: Digi-Key; Supplier Part Number 1: 490-6073-1-ND; Supplier 2: *; Supplier Part Number 2: *
C86 = C0201-3.5p: Capacitor, NP0, ±0.1pF, 25V; Manufacturer: Murata; Manufacturer Part Number: GJM0335C1H3R5BB01E; Part number IPS: 00000001469; Artikkelnr Noca: N.A.; Part Number: C0201-3.5p; ComponentLink1URL: *; ComponentLink1Description: Datasheet; ComponentLink2URL: *; ComponentLink2Description: Supplier link; HelpURL: *; Footprint Doc: 0201; LatestRevisionDate: 2019-02-22; Pin Count: 2; Publisher: Nordic Semiconductor; Published: 2019-02-22; Value: 3.5pF; Note: 25V; Supplier 1: *; Supplier Part Number 1: *; Supplier 2: *; Supplier Part Number 2: *
C87 = C0201-N.C.: Not mounted; Assembly: Not mounted; Note: Chip Cap; Artikkelnr Noca: N.A.; Part Number: C0201-N.C.; Manufacturer: *; Manufacturer Part Number: *; ComponentLink1URL: *; ComponentLink1Description: Datasheet; ComponentLink2URL: *; ComponentLink2Description: Supplier link; HelpURL: *; Footprint Doc: 0201; LatestRevisionDate: 2014-11-13; Pin Count: 2; Publisher: Nordic Semiconductor; Published: 2014-11-13; Value: N.C.; Supplier 1: *; Supplier Part Number 1: *; Supplier 2: *; Supplier Part Number 2: *; Part number IPS: N.A.
C88-C90 = C0201-N.C.: Not mounted; Note: Chip Cap; Artikkelnr Noca: N.A.; Assembly: Not mounted; Part Number: C0201-N.C.; Manufacturer: *; Manufacturer Part Number: *; ComponentLink1URL: *; ComponentLink1Description: Datasheet; ComponentLink2URL: *; ComponentLink2Description: Supplier link; HelpURL: *; Footprint Doc: 0201; LatestRevisionDate: 2014-11-13; Pin Count: 2; Publisher: Nordic Semiconductor; Published: 2014-11-13; Value: N.C.; Part number IPS: N.A.; Supplier 1: *; Supplier Part Number 1: *; Supplier 2: *; Supplier Part Number 2: *
FB1 = FB0402-120R@100M-500mA: Ferrite Bead, 120 Ohm @ 100MHz, 700mA, 130 mOhm Max; Manufacturer: Murata; Manufacturer Part Number: BLM15AX121SN1; Artikkelnr Noca: N.A.; Part Number: FB0402-120R@100M-500mA; ComponentLink1URL: *; ComponentLink1Description: Datasheet; ComponentLink2URL: *; ComponentLink2Description: Supplier link; HelpURL: https://www.murata.com/en-us/products/productdetail.aspx?partno=BLM15AX121SN1%23; Footprint Doc: 0402; LatestRevisionDate: 2020-04-23; Pin Count: 2; Publisher: Nordic Semiconductor; Published: 2020-04-23; Value: 120R/0.70A; Note: *; Part number IPS: N.A.; Supplier 1: Digi-Key; Supplier Part Number 1: 490-5439-1-ND; Supplier 2: *; Supplier Part Number 2: *
J1 = MM8130-2600: Coaxial Connector with Switch; Manufacturer: Murata; Part number IPS: 00000009955; Artikkelnr Noca: 55029011; Part Number: MM8130-2600; Manufacturer Part Number: MM8130-2600; LatestRevisionDate: 2014-04-24; Pin Count: 3; Publisher: Nordic Semiconductor; Published: 2014-04-24; Value: MM8130-2600; Note: *; Footprint Doc: COAXIAL-SWF; ComponentLink1URL: *; ComponentLink1Description: Datasheet; ComponentLink2URL: *; ComponentLink2Description: Supplier link; HelpURL: http://www.murata.com/products/catalog/pdf/o33e.pdf; Supplier 1: Digi-Key; Supplier Part Number 1: 490-4981-1-ND; Supplier 2: Mouser; Supplier Part Number 2: 81-MM8130-2600RA2
J2 = 20279-001E-03: Ultraminiature Coaxial Connector, 50 Ohm, SMD; Manufacturer: Wellshow; Artikkelnr Noca: N.A.; Part Number: 20279-001E-03; Manufacturer Part Number: 20279-001E-03; ComponentLink1URL: \\hizz\pro\app9717\Datasheet\connectors\Wellshow\20279C18.pdf; ComponentLink1Description: Datasheet; ComponentLink2URL: *; ComponentLink2Description: Supplier link; HelpURL: *; Footprint Doc: COAXIAL RF MHFI; LatestRevisionDate: 2020-01-07; Pin Count: 3; Publisher: Nordic Semiconductor; Published: 2020-01-07; Value: MHF I Receptacle; Note: *; Supplier 1: Cabcon; Supplier Part Number 1: 20279-001E-03; Supplier 2: Digi-Key; Supplier Part Number 2: H11891DKR-ND; Part number IPS: N.A.
L1 = L0201-1n5: Inductor, 650mA, ±0.1nH; Manufacturer: Murata; Manufacturer Part Number: LQP03TQ1N5B02D; Part number IPS: 00000000836; Artikkelnr Noca: N.A.; Part Number: L0201-1n5; ComponentLink1URL: *; ComponentLink1Description: Datasheet; ComponentLink2Description: Supplier link; HelpURL: *; Footprint Doc: 0201; LatestRevisionDate: 2013-04-10; Pin Count: 2; Publisher: Nordic Semiconductor; Published: 2013-04-10; Value: 1.5nH; Note: *; ComponentLink2URL: *; Supplier 1: *; Supplier Part Number 1: *; Supplier 2: *; Supplier Part Number 2: *
L2 = L0201-22n: Chip Inductor; Part number IPS: 00000001478; Note: High frequency chip inductor ±10%; Artikkelnr Noca: N.A.; Part Number: L0201-22n; Manufacturer: *; Manufacturer Part Number: *; ComponentLink1URL: *; ComponentLink1Description: Datasheet; ComponentLink2Description: Supplier link; HelpURL: *; Footprint Doc: 0201; LatestRevisionDate: 2019-08-29; Pin Count: 2; Publisher: Nordic Semiconductor; Published: 2013-04-10; Value: 22nH; ComponentLink2URL: *; Supplier 1: *; Supplier Part Number 1: *; Supplier 2: *; Supplier Part Number 2: *
L3 = L0402-68n-Wirewound-Murata: Inductor, 140mA, ±2%, 1960mΩ, Q=20; Manufacturer: Murata; Manufacturer Part Number: LQW15AN68NG00; Part number IPS: 00000002494; Note: -55°C ~ 125°C; Artikkelnr Noca: N.A.; Part Number: L0402-68n-Wirewound-Murata; ComponentLink1URL: https://search.murata.co.jp/Ceramy/image/img/P02/JELF243A-0050.pdf; ComponentLink1Description: Datasheet; ComponentLink2URL: *; ComponentLink2Description: Supplier link; HelpURL: https://psearch.en.murata.com/inductor/product/LQW15AN68NG00%23.html; Footprint Doc: 0402; LatestRevisionDate: 2019-04-16; Pin Count: 2; Publisher: Nordic Semiconductor; Published: 2019-04-16; Value: 68nH; Supplier 1: Digi-Key; Supplier Part Number 1: 490-6837-1-ND; Supplier 2: *; Supplier Part Number 2: *
L4 = L0402-N.C.: Not mounted; Assembly: Not mounted; Artikkelnr Noca: N.A.; Part Number: L0402-N.C.; Manufacturer: *; Manufacturer Part Number: *; ComponentLink1URL: *; ComponentLink1Description: Datasheet; ComponentLink2URL: *; ComponentLink2Description: Supplier link; HelpURL: *; Footprint Doc: 0402; LatestRevisionDate: 2016-11-24; Pin Count: 2; Publisher: Nordic Semiconductor; Published: 2016-11-24; Value: N.C.; Note: *; Supplier 1: *; Supplier Part Number 1: *; Supplier 2: *; Supplier Part Number 2: *; Part number IPS: N.A.
L5 = L0402-N.C.: Not mounted; Artikkelnr Noca: N.A.; Assembly: Not mounted; Part Number: L0402-N.C.; Manufacturer: *; Manufacturer Part Number: *; ComponentLink1URL: *; ComponentLink1Description: Datasheet; ComponentLink2URL: *; ComponentLink2Description: Supplier link; HelpURL: *; Footprint Doc: 0402; LatestRevisionDate: 2016-11-24; Pin Count: 2; Publisher: Nordic Semiconductor; Published: 2016-11-24; Value: N.C.; Note: *; Supplier 1: *; Supplier Part Number 1: *; Supplier 2: *; Supplier Part Number 2: *; Part number IPS: N.A.
L6 = L0402-9n1-Wirewound-Murata: Inductor, 540mA, ±2%, 140mΩ, Q=25; Manufacturer: Murata; Manufacturer Part Number: LQW15AN9N1G00; Part number IPS: 00000002497; Note: -55°C ~ 125°C; Artikkelnr Noca: N.A.; Part Number: L0402-9n1-Wirewound-Murata; ComponentLink1URL: https://search.murata.co.jp/Ceramy/image/img/P02/JELF243A-0050.pdf; ComponentLink1Description: Datasheet; ComponentLink2URL: *; ComponentLink2Description: Supplier link; HelpURL: https://psearch.en.murata.com/inductor/product/LQW15AN9N1G00%23.html; Footprint Doc: 0402; LatestRevisionDate: 2019-04-16; Pin Count: 2; Publisher: Nordic Semiconductor; Published: 2019-04-16; Value: 9.1nH; Supplier 1: Digi-Key; Supplier Part Number 1: 490-6854-1-ND; Supplier 2: *; Supplier Part Number 2: *
Q13 Q14 = DMC2990UDJ-7: MOSFET, Dual N and P-Channel, 20V, 450mA/310mA, 990mOhm, 350mW; Manufacturer: Diodes Incorporated; Artikkelnr Noca: N.A.; Part Number: DMC2990UDJ-7; Manufacturer Part Number: DMC2990UDJ-7; ComponentLink1URL: https://www.diodes.com/assets/Datasheets/DMC2990UDJ.pdf; ComponentLink1Description: Datasheet; ComponentLink2URL: *; ComponentLink2Description: Supplier link; HelpURL: *; Footprint Doc: SOT-963; LatestRevisionDate: 2020-02-21; Pin Count: 6; Publisher: Nordic Semiconductor; Published: 2020-02-21; Value: DMC2990UDJ; Note: *; Supplier 1: Digi-Key; Supplier Part Number 1: DMC2990UDJ-7DICT-ND; Supplier 2: *; Supplier Part Number 2: *; Part number IPS: N.A.
R1 R106 = R0201-10k: Resistor, ±1%, 0.05W; Part number IPS: 00000001255; Note: Chip Res 1%; Artikkelnr Noca: N.A.; Part Number: R0201-10k; Manufacturer: *; Manufacturer Part Number: *; ComponentLink1URL: *; ComponentLink1Description: Datasheet; ComponentLink2URL: *; ComponentLink2Description: Supplier link; HelpURL: *; Footprint Doc: 0201; LatestRevisionDate: 2014-11-13; Pin Count: 2; Publisher: Nordic Semiconductor; Published: 2014-11-13; Value: 10k; Supplier 1: *; Supplier Part Number 1: *; Supplier 2: *; Supplier Part Number 2: *
R2 = R0201-1k0: Resistor, ±1%, 0.05W; Part number IPS: 00000005786; Note: Chip Res 1%; Artikkelnr Noca: N.A.; Part Number: R0201-1k0; Manufacturer: *; Manufacturer Part Number: *; ComponentLink1URL: *; ComponentLink1Description: Datasheet; ComponentLink2URL: *; ComponentLink2Description: Supplier link; HelpURL: *; Footprint Doc: 0201; LatestRevisionDate: 2014-11-13; Pin Count: 2; Publisher: Nordic Semiconductor; Published: 2014-11-13; Value: 1k; Supplier 1: *; Supplier Part Number 1: *; Supplier 2: *; Supplier Part Number 2: *
R3 R6 R8 = R0201-0R: Resistor, ±5%, 0.05W; Part number IPS: 00000003245; Note: Chip Res 5%; Artikkelnr Noca: N.A.; Part Number: R0201-0R; Manufacturer: *; Manufacturer Part Number: *; ComponentLink1URL: *; ComponentLink1Description: Datasheet; ComponentLink2URL: *; ComponentLink2Description: Supplier link; HelpURL: *; Footprint Doc: 0201; LatestRevisionDate: 2017-11-09; Pin Count: 2; Publisher: Nordic Semiconductor; Published: 2014-11-13; Value: 0R; Supplier 1: *; Supplier Part Number 1: *; Supplier 2: *; Supplier Part Number 2: *
R4 = R0402-0R: Resistor, ±5%, 0.063W; Part number IPS: 00000007128; Note: Chip Res 5%; Artikkelnr Noca: 27049000; Part Number: R0402-0R; Manufacturer: *; Manufacturer Part Number: *; ComponentLink1URL: *; ComponentLink1Description: Datasheet; ComponentLink2URL: *; ComponentLink2Description: Supplier link; HelpURL: *; Footprint Doc: 0402; LatestRevisionDate: 2009-11-23; Pin Count: 2; Publisher: Nordic Semiconductor; Published: 2009-05-08; Value: 0R; Supplier 1: Farnell; Supplier Part Number 1: 146-9661; Supplier 2: *; Supplier Part Number 2: *
R9 = R0201-1M0: Resistor, ±1%, 0.05W; Part number IPS: 00000001418; Note: Chip Res 1%; Artikkelnr Noca: N.A.; Part Number: R0201-1M0; Manufacturer: *; Manufacturer Part Number: *; ComponentLink1URL: *; ComponentLink1Description: Datasheet; ComponentLink2URL: *; ComponentLink2Description: Supplier link; HelpURL: *; Footprint Doc: 0201; LatestRevisionDate: 2014-11-13; Pin Count: 2; Publisher: Nordic Semiconductor; Published: 2014-11-13; Value: 1M0; Supplier 1: *; Supplier Part Number 1: *; Supplier 2: *; Supplier Part Number 2: *
R107 = R0201-100k: Resistor, ±1%, 0.05W; Part number IPS: 00000001419; Note: Chip Res 1%; Artikkelnr Noca: N.A.; Part Number: R0201-100k; Manufacturer: *; Manufacturer Part Number: *; ComponentLink1URL: *; ComponentLink1Description: Datasheet; ComponentLink2URL: *; ComponentLink2Description: Supplier link; HelpURL: *; Footprint Doc: 0201; LatestRevisionDate: 2014-11-13; Pin Count: 2; Publisher: Nordic Semiconductor; Published: 2014-11-13; Value: 100k; Supplier 1: *; Supplier Part Number 1: *; Supplier 2: *; Supplier Part Number 2: *
R108 = R0201-N.C.: Not mounted; Note: Chip Res; Artikkelnr Noca: N.A.; Assembly: Not mounted; Part Number: R0201-N.C.; Manufacturer: *; Manufacturer Part Number: *; ComponentLink1URL: *; ComponentLink1Description: Datasheet; ComponentLink2URL: *; ComponentLink2Description: Supplier link; HelpURL: *; Footprint Doc: 0201; LatestRevisionDate: 2014-11-13; Pin Count: 2; Publisher: Nordic Semiconductor; Published: 2014-11-13; Value: N.C.; Supplier 1: *; Supplier Part Number 1: *; Supplier 2: *; Supplier Part Number 2: *; Part number IPS: N.A.
SB1 SB23 = Solderbridge Shorted: Shorted Solderbridge; Artikkelnr Noca: N.A.; Part Number: Solderbridge Shorted; Manufacturer: *; Manufacturer Part Number: *; LatestRevisionDate: 2012-08-07; Pin Count: 2; Publisher: Nordic Semiconductor; Published: 2012-08-07; Value: Solderbridge; Note: *; Footprint Doc: Solderbridge_Shorted; Part number IPS: N.A.; ComponentLink1URL: *; ComponentLink1Description: Datasheet; ComponentLink2URL: *; ComponentLink2Description: Supplier link; HelpURL: *; Supplier 1: *; Supplier Part Number 1: *; Supplier 2: *; Supplier Part Number 2: *
SB2 = Solderbridge: Artikkelnr Noca: N.A.; Part Number: Solderbridge; Manufacturer: *; Manufacturer Part Number: *; LatestRevisionDate: 2009-12-14; Pin Count: 2; Publisher: Nordic Semiconductor; Published: 2009-12-14; Value: Solderbridge; Note: *; Footprint Doc: Solderbridge; Part number IPS: N.A.; ComponentLink1URL: *; ComponentLink1Description: Datasheet; ComponentLink2URL: *; ComponentLink2Description: Supplier link; HelpURL: *; Supplier 1: *; Supplier Part Number 1: *; Supplier 2: *; Supplier Part Number 2: *
TP2-TP9 = TP_SMD_Ø1.0MM: 1.0mm circular SMD testpad; Manufacturer: Nordic Semiconductor; Artikkelnr Noca: N.A.; Part Number: TP_SMD_Ø1.0MM; Manufacturer Part Number: *; ComponentLink1URL: *; ComponentLink1Description: Datasheet; ComponentLink2URL: *; ComponentLink2Description: Supplier link; HelpURL: *; Footprint Doc: TP_SMD_Ø1.0mm; LatestRevisionDate: 2013-06-11; Pin Count: 1; Publisher: Nordic Semiconductor; Published: 2013-06-11; Value: Ø1.0mm,SMD; Note: *; Part number IPS: N.A.; Supplier 1: *; Supplier Part Number 1: *; Supplier 2: *; Supplier Part Number 2: *
TP55-TP57 = TP_SMD_Ø1.5MM: 1.5mm circular SMD testpad; Manufacturer: Nordic Semiconductor; Artikkelnr Noca: N.A.; Part Number: TP_SMD_Ø1.5MM; Manufacturer Part Number: *; ComponentLink1URL: *; ComponentLink1Description: Datasheet; ComponentLink2URL: *; ComponentLink2Description: Supplier link; HelpURL: *; Footprint Doc: TP_SMD_Ø1.5mm; LatestRevisionDate: 2016-06-02; Pin Count: 1; Publisher: Nordic Semiconductor; Published: 2016-06-02; Value: Ø1.5mm,SMD; Note: *; Supplier 1: *; Supplier Part Number 1: *; Supplier 2: *; Supplier Part Number 2: *; Part number IPS: N.A.
U1 = nRF9160-SICAB1A: Low power System-in-Package with integrated LTE-M/NB-IoT modem and GPS; Manufacturer: Nordic Semiconductor; Part number IPS: 80000002329; Artikkelnr Noca: N.A.; Part Number: nRF9160-SICAB1A; Manufacturer Part Number: nRF9160-SICAB1A; Footprint Doc: LGA-161; Pin Count: 161; Value: nRF9160-SICAB1A; ComponentLink1URL: *; ComponentLink1Description: Datasheet; ComponentLink2URL: *; ComponentLink2Description: Supplier link; HelpURL: *; LatestRevisionDate: 2020-08-13; Publisher: Nordic Semiconductor; Published: 2020-08-13; Note: *; Supplier 1: Nordic Semiconductor; Supplier Part Number 1: nRF9160-SICAB1A; Supplier 2: *; Supplier Part Number 2: *
U2 = SKY65943-11: GNSS Low-Noise Amplifier Front-End Module with Integrated Pre-Filter and Post-Filter; Manufacturer: Skyworks; Part number IPS: 00000002997; Artikkelnr Noca: N.A.; Part Number: SKY65943-11; Manufacturer Part Number: SKY65943-11; Footprint Doc: MCM-10; Pin Count: 10; Value: SKY65943-11; ComponentLink1URL: http://www.skyworksinc.com/uploads/documents/SKY65943_11_204404F.pdf; ComponentLink1Description: Datasheet; ComponentLink2URL: https://www.digikey.com/product-detail/en/skyworks-solutions-inc/SKY65943-11/863-2032-1-ND; ComponentLink2Description: Supplier link; HelpURL: http://www.skyworksinc.com/Product/3579/SKY65943-11; LatestRevisionDate: 2019-04-16; Publisher: Nordic Semiconductor; Published: 2019-04-16; Note: *; Supplier 1: Digi-Key; Supplier Part Number 1: 863-2032-1-ND; Supplier 2: Mouser; Supplier Part Number 2: 873-SKY65943-11